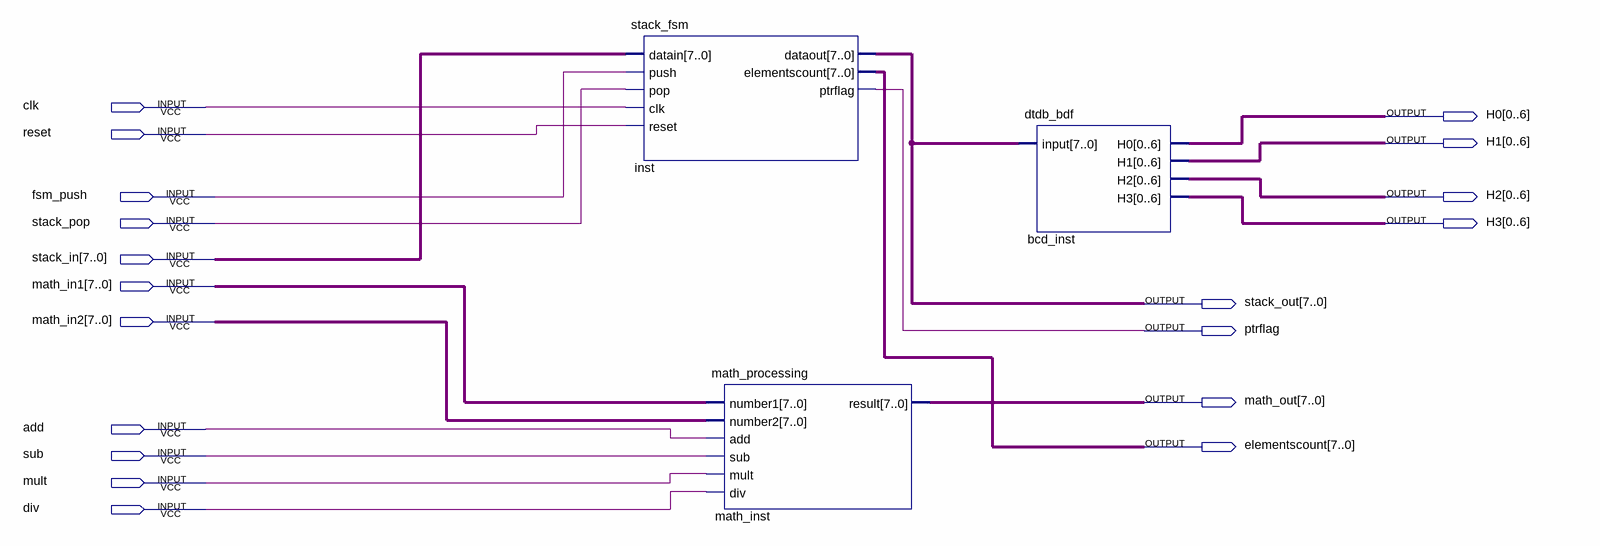
[diagram p0: schematic sheet]
// Quartus schematic bo.bdf as structural Verilog: 3 symbols, 19 pins
module bo (
  input  clk,
  input  reset,
  input  fsm_push,
  input  stack_pop,
  input  [7:0] stack_in,
  input  [7:0] math_in1,
  input  [7:0] math_in2,
  input  add,
  input  sub,
  input  mult,
  input  div,
  output [0:6] H0,
  output [0:6] H1,
  output [0:6] H2,
  output [0:6] H3,
  output [7:0] stack_out,
  output ptrflag,
  output [7:0] math_out,
  output [7:0] elementscount
);

  stack_fsm inst (
    .datain(stack_in), .push(fsm_push), .pop(stack_pop), .clk(clk), .reset(reset), .dataout(stack_out),
    .elementscount(elementscount), .ptrflag(ptrflag));
  math_processing math_inst (
    .number1(math_in1), .number2(math_in2), .add(add), .sub(sub), .mult(mult), .div(div), .result(math_out));
  dtdb_bdf bcd_inst (.\input (stack_out), .H0(H0), .H1(H1), .H2(H2), .H3(H3));
endmodule
